# Altium project MB1397.PrjPcb (part 4 of 9)

## Sheet STM32_microcontroller_power.SchDoc: STM32_microcontroller_power
size A4; Date: Not used; ApprovedBy: Not used; CheckedBy: Not used; Author: Not used; CompanyName: STMicroelectronics; DrawnBy: Not used; Engineer: Not used; Organization: Not used; Address1: Not used; Address2: Not used; Address3: Not used; Address4: Not used; DocumentNumber: Not used; Revision: Not used; SheetNumber: 4; SheetTotal: 22; CurrentTime: Not used; CurrentDate: Not used; Time: Not used; DocumentFullPathAndName: Not used; DocumentName: Not used; ModifiedDate: Not used; ImagePath: Not used; ProjectName: Not used; Application_BuildNumber: Not used
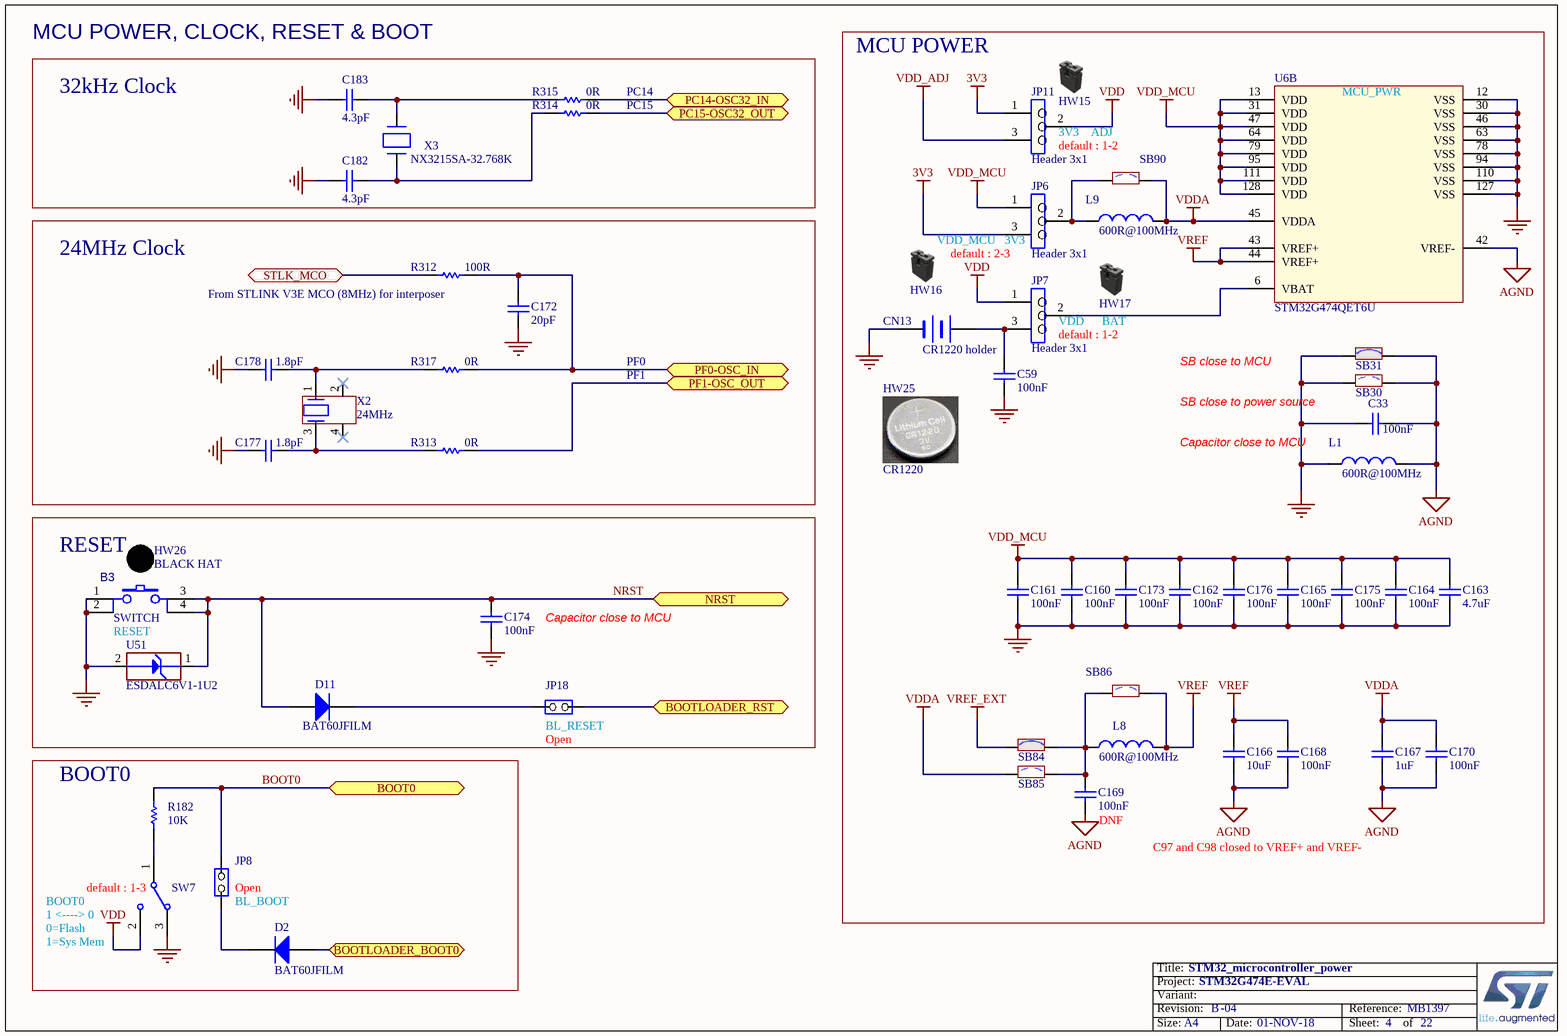
[diagram p10: STM32_microcontroller_power.SchDoc]

### Parts
B3  value SWITCH  [SWI_WEALTHMETAL_TD-0341_4P_BLACK]  (hidden comment: SW-PUSH-CMS)
C33  value 100nF  [C0402]  (hidden comment: Capacitor)
C59  value 100nF  [C0402]  (hidden comment: Capacitor)
C160  value 100nF  [C0402]  (hidden comment: Capacitor)
C161  value 100nF  [C0402]  (hidden comment: Capacitor)
C162  value 100nF  [C0402]  (hidden comment: Capacitor)
C163  value 4.7uF  [C0603]  (hidden comment: Capacitor)
C164  value 100nF  [C0402]  (hidden comment: Capacitor)
C165  value 100nF  [C0402]  (hidden comment: Capacitor)
C166  value 10uF  [C0805]  (hidden comment: Capacitor)
C167  value 1uF  [C0603]  (hidden comment: Capacitor)
C168  value 100nF  [C0402]  (hidden comment: Capacitor)
C169  value 100nF  [C0402]  (hidden comment: Capacitor)
C170  value 100nF  [C0402]  (hidden comment: Capacitor)
C172  value 20pF  [C0402]  (hidden comment: Capacitor)
C173  value 100nF  [C0402]  (hidden comment: Capacitor)
C174  value 100nF  [C0402]  (hidden comment: Capacitor)
C175  value 100nF  [C0402]  (hidden comment: Capacitor)
C176  value 100nF  [C0402]  (hidden comment: Capacitor)
C177  value 1.8pF  [C0402]  (hidden comment: Capacitor)
C178  value 1.8pF  [C0402]  (hidden comment: Capacitor)
C182  value 4.3pF  [C0402]  (hidden comment: Capacitor)
C183  value 4.3pF  [C0402]  (hidden comment: Capacitor)
CN13  value CR1220 holder  [BAT_HARWIN_S8411-45R_SMD_2P]  (hidden comment: BATTERY HOLDER)
D2  BAT60JFILM  [DIO_SOD323]
D11  BAT60JFILM  [DIO_SOD323]
HW15  Shunt Black 2.54mm  (value not drawn)  (mechanical)
HW16  Shunt Black 2.54mm  (value not drawn)  (mechanical)
HW17  Shunt Black 2.54mm  (value not drawn)  (mechanical)
HW25  value CR1220  (hidden comment: BBU_CR1220)  (mechanical)
HW26  value BLACK HAT  (hidden comment: BUTTON_HAT_BLACK)  (mechanical)
JP6  value Header 3x1  [CON_SAMTEC_TSW-103-07-F-S]  (hidden comment: Jumper_Header 3x1)
JP7  value Header 3x1  [CON_SAMTEC_TSW-103-07-F-S]  (hidden comment: Jumper_Header 3x1)
JP8  Jumper_Header 2x1  [CON_SAMTEC_TSW-102-07-G-S]  (value not drawn)
JP11  value Header 3x1  [CON_SAMTEC_TSW-103-07-F-S]  (hidden comment: Jumper_Header 3x1)
JP18  Jumper_Header 2x1  [CON_SAMTEC_TSW-102-07-G-S]  (value not drawn)
L1  value 600R@100MHz  [L0603]  (hidden comment: BEAD)
L8  value 600R@100MHz  [L0603]  (hidden comment: BEAD)
L9  value 600R@100MHz  [L0603]  (hidden comment: BEAD)
R182  value 10K  [R0402]  (hidden comment: Resistor)
R312  value 100R  [R0402]  (hidden comment: Resistor)
R313  value 0R  [R0402]  (hidden comment: Resistor)
R314  value 0R  [R0402]  (hidden comment: Resistor)
R315  value 0R  [R0402]  (hidden comment: Resistor)
R317  value 0R  [R0402]  (hidden comment: Resistor)
SB30  SB_OFF  [SOLDER-BRIDGE_R0603-0R]  (value not drawn)
SB31  SB_ON  [SOLDER-BRIDGE_R0603-0R]  (value not drawn)
SB84  SB_ON  [SOLDER-BRIDGE_R0603-0R]  (value not drawn)
SB85  SB_OFF  [SOLDER-BRIDGE_R0603-0R]  (value not drawn)
SB86  SB_OFF  [SOLDER-BRIDGE_R0603-0R]  (value not drawn)
SB90  SB_OFF  [SOLDER-BRIDGE_R0603-0R]  (value not drawn)
SW7  SW_MECA_1K2  [SWI_EAO_09-03290-01_EXTENDED_STRAIGHT_BLACK]  (value not drawn)
U6  STM32G474QET6U  [ICC_LQFP128_14X14_P040]  (part B of 2)
U51  value ESDALC6V1-1U2  [ESD_ST0201]  (hidden comment: ESD-TRANSIL)
X2  value 24MHz  [CRY_NX2016SA_4P]  (hidden comment: XTAL_4_PINS)
X3  value NX3215SA-32.768K  [CRY_NX3215SA_2P]  (hidden comment: XTAL_2_PINS)

### Blocks framed on the sheet
MCU POWER: C33 C59 C160-C170 C173 C175 C176 CN13 HW15-HW17 HW25 JP6 JP7 JP11 L1 L8 L9 SB30 SB31 SB84-SB86 SB90 U6
24MHz Clock: C172 C177 C178 R312 R313 R317 X2
RESET: B3 C174 D11 HW26 JP18 U51
BOOT0: D2 JP8 R182 SW7

### Ports
BOOT0, BOOTLOADER_BOOT0, BOOTLOADER_RST, NRST, PC14-OSC32_IN, PC15-OSC32_OUT, PF0-OSC_IN, PF1-OSC_OUT, STLK_MCO

### Nets
3V3: JP6.3 JP11.1
AGND: C33.1 C166.1 C167.2 C168.1 C169.1 C170.1 L1.2 SB30.2 SB31.2 U6.42(VREF-)
GND: B3.1 B3.2 C33.2 C59.1 C160.1 C161.1 C162.1 C163.2 C164.1 C165.1 C172.2 C173.1 C174.1 C175.1 C176.1 C177.1 C178.1 C182.1 C183.1 CN13.2(-) L1.1 SB30.1 SB31.1 SW7.3 U6.12(VSS) U6.30(VSS) U6.46(VSS) U6.63(VSS) U6.78(VSS) U6.94(VSS) U6.110(VSS) U6.127(VSS) U51.2(GND)
VDD: JP7.1 JP11.2 SW7.2
VDD_ADJ: JP11.3
VDD_MCU: C160.2 C161.2 C162.2 C163.1 C164.2 C165.2 C173.2 C175.2 C176.2 JP6.1 U6.13(VDD) U6.31(VDD) U6.47(VDD) U6.64(VDD) U6.79(VDD) U6.95(VDD) U6.111(VDD) U6.128(VDD)
VDDA: C167.1 C170.2 L9.2 SB85.1 SB90.2 U6.45(VDDA)
VREF: C166.2 C168.2 L8.2 SB86.2 U6.43(VREF+) U6.44(VREF+)
VREF_EXT: SB84.1
BOOT0: JP8.2(NO) R182.1 ; port BOOT0
NRST: B3.3 B3.4 C174.2 D11.1(A) U51.1(IO1) ; port NRST
PC14: R315.2 ; port PC14-OSC32_IN
PC15: R314.2 ; port PC15-OSC32_OUT
PF0: C172.1 R312.2 R317.2 ; port PF0-OSC_IN
PF1: R313.2 ; port PF1-OSC_OUT
NetC59_2: C59.2 CN13.1(+) JP7.3
NetC169_2: C169.2 L8.1 SB84.2 SB85.2 SB86.1
NetC177_2: C177.2 R313.1 X2.3
NetC178_2: C178.2 R317.1 X2.1
NetC182_2: C182.2 R314.1 X3.1(X1)
NetC183_2: C183.2 R315.1 X3.2(X2)
NetD2_1: D2.1(A) ; port BOOTLOADER_BOOT0
NetD2_2: D2.2(K) JP8.1(COMMON)
NetD11_2: D11.2(K) JP18.1(COMMON)
NetJP6_2: JP6.2 L9.1 SB90.1
NetJP7_2: JP7.2 U6.6(VBAT)
NetJP18_2: JP18.2(NO) ; port BOOTLOADER_RST
NetR182_2: R182.2 SW7.1
NetR312_1: R312.1 ; port STLK_MCO

Not connected (* = marked no-connect by the designer): X2 2* 4*

### Notes on the sheet
- MCU POWER, CLOCK, RESET & BOOT
- 32kHz Clock
- PC14
- PC15
- (near JP11) default : 1-2
- (near JP11) 3V3    ADJ
- VDD_MCU   3V3
- (near R312) From STLINK V3E MCO (8MHz) for interposer
- (near JP6) default : 2-3
- PF0
- PF1
- (near JP7) default : 1-2
- (near JP7) VDD      BAT
- SB close to MCU
- (near L1) Capacitor close to MCU
- SB close to power source
- (near B3) RESET
- Capacitor close to MCU
- (near JP18) Open
- (near JP18) BL_RESET
- (near C169) DNF
- C97 and C98 closed to VREF+ and VREF-
- BOOT0
- (near SW7) 1 <----> 0
- (near SW7) default : 1-3
- (near JP8) Open
- (near JP8) BL_BOOT
- (near SW7) 0=Flash
- (near SW7) 1=Sys Mem
- Title:
- Project:
- Size:
- Revision:
- Variant:
- A4
- -
- Date:
- Reference:
- Sheet:
- of
- (in symbol MCD-01707, part B) MCU_PWR

### Library data of the parts
B3 = MCD-00001: Non-Open Push-Button 0.1A 24V BLACK; Manufacturer_Part_Number: TD-0341; Manufacturer: WEALTHMETAL; Part_Type: Misc; Provided_By: SUBCO; Initial_Board_Reference: MB1274; Remark: update MPN removed color, as it is done by HAT, removed Farnell code as it is not good; Path: ws/MCD_ApplicationBoards/Lists/MCDPARTSdatabase; Item Type: Item; Internal_Part_Number: MCD-00001; ComponentLink1Description: Datasheet; Status: Released; ComponentLink1URL: http://tunmcdsvn.tun.st.com/Component_Datasheet_Library/Trunk/Misc/Wealthmetal_Tact-Switch_TD0341
C33 C59 C160-C162 C164 C165 C168-C170 C173-C176 = MCD-00006: Capacitor, MLCC, 100nF, 16V, X7R, 10%, 0402, T=0.5mm; Manufacturer_Part_Number: CC0402KRX7R7BB104; Manufacturer: YAGEO; Alternate_Manufacturer_Part_Number: GCM155R71C104KA55D; Alternate_Manufacturer: MURATA; Provided_By: SUBCO; Initial_Board_Reference: MB1274; Path: ws/MCD_ApplicationBoards/Lists/MCDPARTSdatabase; Item Type: Item; Internal_Part_Number: MCD-00006; Status: Released; Part_Type: Capacitor; Package: C0402; ComponentLink1Description: Datasheet; ComponentLink1URL: http://tunmcdsvn.tun.st.com/Component_Datasheet_Library/Trunk/Capacitors/Yageo_Multilayer_Capacitor_X7R_series_100pF_to_22uF
C163 = MCD-00009: Capacitor, MLCC, 4.7uF, 16V, X5R, 10%, 0603, T=0.8mm; Manufacturer_Part_Number: CC0603KRX5R7BB475; Manufacturer: YAGEO; Provided_By: SUBCO; Initial_Board_Reference: MB1274; Path: ws/MCD_ApplicationBoards/Lists/MCDPARTSdatabase; Item Type: Item; Internal_Part_Number: MCD-00009; Status: Released; Part_Type: Capacitor; ComponentLink1Description: Datasheet; ComponentLink1URL: http://tunmcdsvn.tun.st.com/Component_Datasheet_Library/Trunk/Capacitors/Yageo_Multilayer_capacitor_X5R_series_100pF_to_100uF; Package: C0603
C166 = MCD-00014: Capacitor, MLCC, 10uF, 25V, X5R, 10%, 0805, T=0,85mm; Manufacturer_Part_Number: CC0805KRX5R8BB106; Manufacturer: YAGEO; Provided_By: SUBCO; Initial_Board_Reference: MB1274; Path: ws/MCD_ApplicationBoards/Lists/MCDPARTSdatabase; Item Type: Item; Internal_Part_Number: MCD-00014; ComponentLink1Description: Datasheet; Status: Released; Part_Type: Capacitor; Package: C0805; ComponentLink1URL: http://tunmcdsvn.tun.st.com/Component_Datasheet_Library/Trunk/Capacitors/Yageo_Multilayer_capacitor_X5R_series_100pF_to_100uF
C167 = MCD-00010: Capacitor, MLCC, 1uF, 16V, X5R, 10%, 0603, T=0,8mm; Manufacturer_Part_Number: CC0603KRX5R7BB105; Manufacturer: YAGEO; Provided_By: SUBCO; Initial_Board_Reference: MB1274; Path: ws/MCD_ApplicationBoards/Lists/MCDPARTSdatabase; Item Type: Item; Internal_Part_Number: MCD-00010; Status: Released; Part_Type: Capacitor; ComponentLink1Description: Datasheet; ComponentLink1URL: http://tunmcdsvn.tun.st.com/Component_Datasheet_Library/Trunk/Capacitors/Yageo_Multilayer_capacitor_X5R_series_100pF_to_100uF; Package: C0603
C172 = MCD-00016: Capacitor, MLCC, 20pF, 50V, NPO, 5%, 0402, T=0,5mm; Manufacturer_Part_Number: CC0402JRNPO9BN200; Manufacturer: YAGEO; Provided_By: SUBCO; Initial_Board_Reference: MB1274; Path: ws/MCD_ApplicationBoards/Lists/MCDPARTSdatabase; Item Type: Item; Internal_Part_Number: MCD-00016; Status: Released; Package: C0402; ComponentLink1Description: Datasheet; Part_Type: Capacitor; ComponentLink1URL: http://tunmcdsvn.tun.st.com/Component_Datasheet_Library/Trunk/Capacitors/Yageo_Capacitor_NP0_16V-to-50V
C177 C178 = MCD-01598: Capacitor, MLCC, 1.8pF, 50V, NPO, +-0.25pF, 0402, T=0,5mm; Manufacturer_Part_Number: CC0402CRNPO9BN1R8; Manufacturer: YAGEO; Provided_By: SUBCO; Internal_Part_Number: MCD-01598; Status: Released; Part_Type: Capacitor; Package: C0402; ComponentLink1Description: Datasheet; ComponentLink1URL: http://tunmcdsvn.tun.st.com/Component_Datasheet_Library/Trunk/Capacitors/Yageo_Capacitor_NP0_16V-to-50V
C182 C183 = MCD-01706: Capacitor, MLCC, 4.3pF, 50V, NPO, +-0.25pF, 0402, T=0,5mm; Manufacturer_Part_Number: CC0402CRNPO9BN4R3; Manufacturer: YAGEO; Provided_By: SUBCO; Internal_Part_Number: MCD-01706; Status: Footprint available; Part_Type: Capacitor; Package: C0402; ComponentLink1Description: Datasheet; ComponentLink1URL: http://tunmcdsvn.tun.st.com/Component_Datasheet_Library/Trunk/Capacitors/Yageo_Capacitor_NP0_16V-to-50V
CN13 = MCD-00558: Battery Coin Cell holder, CR1220_12mm, Height 4.25mm; Part_Type: Connector; Manufacturer_Part_Number: S8411-45R; Manufacturer: HARWIN; Provided_By: SUBCO; Initial_Board_Reference: MB1331; Path: ws/MCD_ApplicationBoards/Lists/MCDPARTSdatabase; Item Type: Item; Internal_Part_Number: MCD-00558; Status: Released; ComponentLink1Description: Datasheet; ComponentLink1URL: http://tunmcdsvn.tun.st.com/Component_Datasheet_Library/Trunk/Connectors/Harwin_S8_series
D2 D11 = MCD-00034: Manufacturer: STMICROELECTRONICS; Part_Type: Diode; BMS_Part_Number: 9151097; Provided_By: SUBCO with ST control; Initial_Board_Reference: MB1274; Path: ws/MCD_ApplicationBoards/Lists/MCDPARTSdatabase; Item Type: Item; Internal_Part_Number: MCD-00034; Value: BAT60JFILM; Manufacturer_Part_Number: BAT60JFILM; ComponentLink1Description: Datasheet; Status: Released; ComponentLink1URL: http://tunmcdsvn.tun.st.com/Component_Datasheet_Library/Trunk/Diodes/STM_Diode_BAT60JFILM-SOD323
HW15-HW17 = MCD-00043: SHUNT 2.54mm BLACK; Part_Type: Mechanical; Manufacturer_Part_Number: SNT-100-BK-G; Manufacturer: SAMTEC; Provided_By: SUBCO; Initial_Board_Reference: MB1274; Value: SNT-100-BK-G; Path: ws/MCD_ApplicationBoards/Lists/MCDPARTSdatabase; Item Type: Item; Internal_Part_Number: MCD-00043; Status: Released; ComponentLink1Description: Datasheet; ComponentLink1URL: http://tunmcdsvn.tun.st.com/Component_Datasheet_Library/Trunk/Connectors/Samtec_Shunt_Jumper_SNT100
HW25 = MCD-01197: Battery Back-Up CR1220,3V,12X2.0MM,35mA; Part_Type: Misc; Manufacturer: tbd; Alternate_Manufacturer_Part_Number: 988.16.04.2.00003; Alternate_Manufacturer: Jiubaba; Provided_By: SUBCO; Initial_Board_Reference: MB1372; Remark: Mechanical part, no footprint.; Path: ws/MCD_ApplicationBoards/Lists/MCDPARTSdatabase; Item Type: Item; Internal_Part_Number: MCD-01197; Status: Checked; Manufacturer_Part_Number: CR1220; Package: CR1220; ComponentLink1Description: Datasheet; ComponentLink1URL: http://na
HW26 = MCD-00635: Black Hat for switch TD0341X-G01-BLA; Part_Type: Mechanical; Manufacturer_Part_Number: 988.16.09.3.00003_SH-517; Manufacturer: JIUBABA; Provided_By: SUBCO; Initial_Board_Reference: MB1319; Item Type: Item; Path: ws/MCD_ApplicationBoards/Lists/MCDPARTSdatabase; Internal_Part_Number: MCD-00635; Status: Released; ComponentLink1Description: Datasheet; ComponentLink1URL: http://tunmcdsvn.tun.st.com/Component_Datasheet_Library/Trunk/Mechanical/Jiubaba_HAT_SH-517
JP6 JP7 JP11 = MCD-00111: Header, 3x1, 2,54mm, VR, TH, Height 5.84mm/2.54mm; Part_Type: Connector; Manufacturer_Part_Number: TSW-103-07-F-S; Manufacturer: SAMTEC; Provided_By: SUBCO; Initial_Board_Reference: MB1262; Path: ws/MCD_ApplicationBoards/Lists/MCDPARTSdatabase; Item Type: Item; Internal_Part_Number: MCD-00111; Status: Released; ComponentLink1Description: Datasheet; ComponentLink1URL: http://tunmcdsvn.tun.st.com/Component_Datasheet_Library/Trunk/Connectors/Samtec_TSW-HTSW-series
JP8 JP18 = MCD-00045: Header, 2x1, 2,54mm, VR, TH, Height 5.84mm/2.54mm; Manufacturer_Part_Number: TSW-102-07-x-S; Manufacturer: SAMTEC; Part_Type: Connector; Value: Shunt not fitted; Provided_By: SUBCO; Initial_Board_Reference: MB1274; Path: ws/MCD_ApplicationBoards/Lists/MCDPARTSdatabase; Item Type: Item; Internal_Part_Number: MCD-00045; ComponentLink1Description: Datasheet; Status: Released; ComponentLink1URL: http://tunmcdsvn.tun.st.com/Component_Datasheet_Library/Trunk/Connectors/Samtec_TSW-HTSW-series
L1 L8 L9 = MCD-00047: SMD Chip ferrite bead, 600R@100MHz +/-25%, 350mA, 500mohm DC, 0603, T=0.8mm; Part_Type: Inductor; Manufacturer_Part_Number: FCM1608KF-601T03; Manufacturer: TAI-TECH; Provided_By: SUBCO; Initial_Board_Reference: MB1274; Path: ws/MCD_ApplicationBoards/Lists/MCDPARTSdatabase; Item Type: Item; Internal_Part_Number: MCD-00047; Status: Released; ComponentLink1Description: Datasheet; ComponentLink1URL: http://tunmcdsvn.tun.st.com/Component_Datasheet_Library/Trunk/Inductors/TaiTech_Bead_FCM1608_series
R182 = MCD-00053: Resistor,10K,0402,1%,1/16W; Manufacturer_Part_Number: RC0402FR-0710KL; Manufacturer: YAGEO; Provided_By: SUBCO; Initial_Board_Reference: MB1274; Path: ws/MCD_ApplicationBoards/Lists/MCDPARTSdatabase; Item Type: Item; Internal_Part_Number: MCD-00053; ComponentLink1Description: Datasheet; Status: Released; Part_Type: Resistor; Package: R0402; ComponentLink1URL: http://tunmcdsvn.tun.st.com/Component_Datasheet_Library/Trunk/Resistors/Yageo_Resistor_RC0402-series
R312 = MCD-00119: Resistor,100R,0402,1%,1/16W; Manufacturer_Part_Number: RC0402FR-07100RL; Manufacturer: YAGEO; Provided_By: SUBCO; Initial_Board_Reference: MB1262; Path: ws/MCD_ApplicationBoards/Lists/MCDPARTSdatabase; Item Type: Item; Internal_Part_Number: MCD-00119; Status: Released; Part_Type: Resistor; ComponentLink1Description: Datasheet; Package: R0402; ComponentLink1URL: http://tunmcdsvn.tun.st.com/Component_Datasheet_Library/Trunk/Resistors/Yageo_Resistor_RC0402-series
R313-R315 R317 = MCD-00052: Resistor,0R,0402,5%,1/16W; Manufacturer_Part_Number: RC0402JR-070RL; Manufacturer: YAGEO; Provided_By: SUBCO; Initial_Board_Reference: MB1274; Path: ws/MCD_ApplicationBoards/Lists/MCDPARTSdatabase; Item Type: Item; Internal_Part_Number: MCD-00052; Status: Released; Part_Type: Resistor; Package: R0402; ComponentLink1Description: Datasheet; ComponentLink1URL: http://tunmcdsvn.tun.st.com/Component_Datasheet_Library/Trunk/Resistors/Yageo_Resistor_RC0402-series
SB30 SB85 SB86 SB90 = MCD-00072: Solder Bridge OFF; Part_Type: Mechanical; Manufacturer_Part_Number: RC0603JR-070RL; Manufacturer: YAGEO; Provided_By: SUBCO; Initial_Board_Reference: MB1274; Path: ws/MCD_ApplicationBoards/Lists/MCDPARTSdatabase; Item Type: Item; Internal_Part_Number: MCD-00072; Status: Released; ComponentLink1Description: Datasheet; Package: SB0603; ComponentLink1URL: http://tunmcdsvn.tun.st.com/Component_Datasheet_Library/Trunk/Resistors/Yageo_Resistor_RC0603-series
SB31 SB84 = MCD-00071: Solder Bridge ON; Part_Type: Mechanical; Manufacturer_Part_Number: RC0603JR-070RL; Manufacturer: YAGEO; Provided_By: SUBCO; Initial_Board_Reference: MB1274; Path: ws/MCD_ApplicationBoards/Lists/MCDPARTSdatabase; Item Type: Item; Internal_Part_Number: MCD-00071; Status: Released; ComponentLink1Description: Datasheet; Package: SB0603; ComponentLink1URL: http://tunmcdsvn.tun.st.com/Component_Datasheet_Library/Trunk/Resistors/Yageo_Resistor_RC0603-series
SW7 = MCD-00566: Mechanical Slide Switches 1K2 BLK ACT GOLD STRT MNT; Part_Type: Misc; Manufacturer_Part_Number: 09.03290.01; Manufacturer: EAO; Value: Mechanical Slide Switch 1K2; Provided_By: SUBCO; Initial_Board_Reference: MB1331; Path: ws/MCD_ApplicationBoards/Lists/MCDPARTSdatabase; Item Type: Item; Internal_Part_Number: MCD-00566; Status: Checked; ComponentLink1Description: Datasheet; ComponentLink1URL: http://tunmcdsvn.tun.st.com/Component_Datasheet_Library/Trunk/Misc/EAO_SWITCH_09.03290.01
U6 = MCD-01707: ARM® Cortex®-M4 32-bit MCU, 512 KB Flash, 96 KB RAM, 5x USART, timers, ADC, DAC, comm. I/F, 1.65-3.6V; Part_Type: IC; Manufacturer: STMICROELECTRONICS; Provided_By: SUBCO with ST control; Internal_Part_Number: MCD-01707; Value: STM32G474QET6U; Status: Released; Manufacturer_Part_Number: STM32G474QET6U; Package: LQFP128; ComponentLink1Description: Datasheet; ComponentLink1URL: http://tunmcdsvn.tun.st.com/Component_Datasheet_Library/Trunk/IC/STM_MCU_STM32G474WET6
U51 = MCD-00170: ESD protection 6V1; Part_Type: Diode; Manufacturer: STMICROELECTRONICS; BMS_Part_Number: 9151132; Provided_By: SUBCO with ST control; Initial_Board_Reference: MB1274; Path: ws/MCD_ApplicationBoards/Lists/MCDPARTSdatabase; Item Type: Item; Internal_Part_Number: MCD-00170; Status: Released; Manufacturer_Part_Number: ESDALC6V1-1U2; ComponentLink1Description: Datasheet; ComponentLink1URL: http://tunmcdsvn.tun.st.com/Component_Datasheet_Library/Trunk/Diodes/STM_ESD_ESDALC6V1-1U2
X2 = MCD-01036: 24MHz crystal oscillator - Cl:6pf -; Part_Type: Crystal_Osc; Manufacturer_Part_Number: NX2016SA 24MHz EXS00A-CS10820; Manufacturer: NDK; BMS_Part_Number: 9157045; Provided_By: ST; Initial_Board_Reference: MB1332; Path: ws/MCD_ApplicationBoards/Lists/MCDPARTSdatabase; Item Type: Item; Internal_Part_Number: MCD-01036; Status: Checked; Package: (2016) 2.0 x 1.6 x 0.45 mm; ComponentLink1Description: Datasheet; ComponentLink1URL: http://tunmcdsvn.tun.st.com/Component_Datasheet_Library/Trunk/Crystal_Osc/NDK_NX2016SA 24MHz EXS00A-CS10820 (EXS10B-27366B)
X3 = MCD-00091: Crystal 32.768kHz, 6pF, -+20PPM, R=50K, SMD; Part_Type: Crystal_Osc; Manufacturer_Part_Number: NX3215SA 32.768KHz EXS00A-MU00525; Manufacturer: NDK; BMS_Part_Number: 9157034; Provided_By: ST; Initial_Board_Reference: MB1274; Path: ws/MCD_ApplicationBoards/Lists/MCDPARTSdatabase; Item Type: Item; Internal_Part_Number: MCD-00091; Status: Released; ComponentLink1Description: Datasheet; ComponentLink1URL: http://tunmcdsvn.tun.st.com/Component_Datasheet_Library/Trunk/Crystal_Osc/NDK_Crystal-For-ST_NX3215SA 32.768KHz EXS00A-MU00525 (EXS10B-21238)

## Sheet Power_Board.SchDoc: Board Power
size A4; Date: Not used; ApprovedBy: Not used; CheckedBy: Not used; Author: Not used; CompanyName: STMicroelectronics; DrawnBy: Not used; Engineer: Not used; Organization: Not used; Address1: Not used; Address2: Not used; Address3: Not used; Address4: Not used; DocumentNumber: Not used; Revision: Not used; SheetNumber: 20; SheetTotal: 22; CurrentTime: Not used; CurrentDate: Not used; Time: Not used; DocumentFullPathAndName: Not used; DocumentName: Not used; ModifiedDate: Not used; ImagePath: Not used; ProjectName: Not used; Application_BuildNumber: Not used
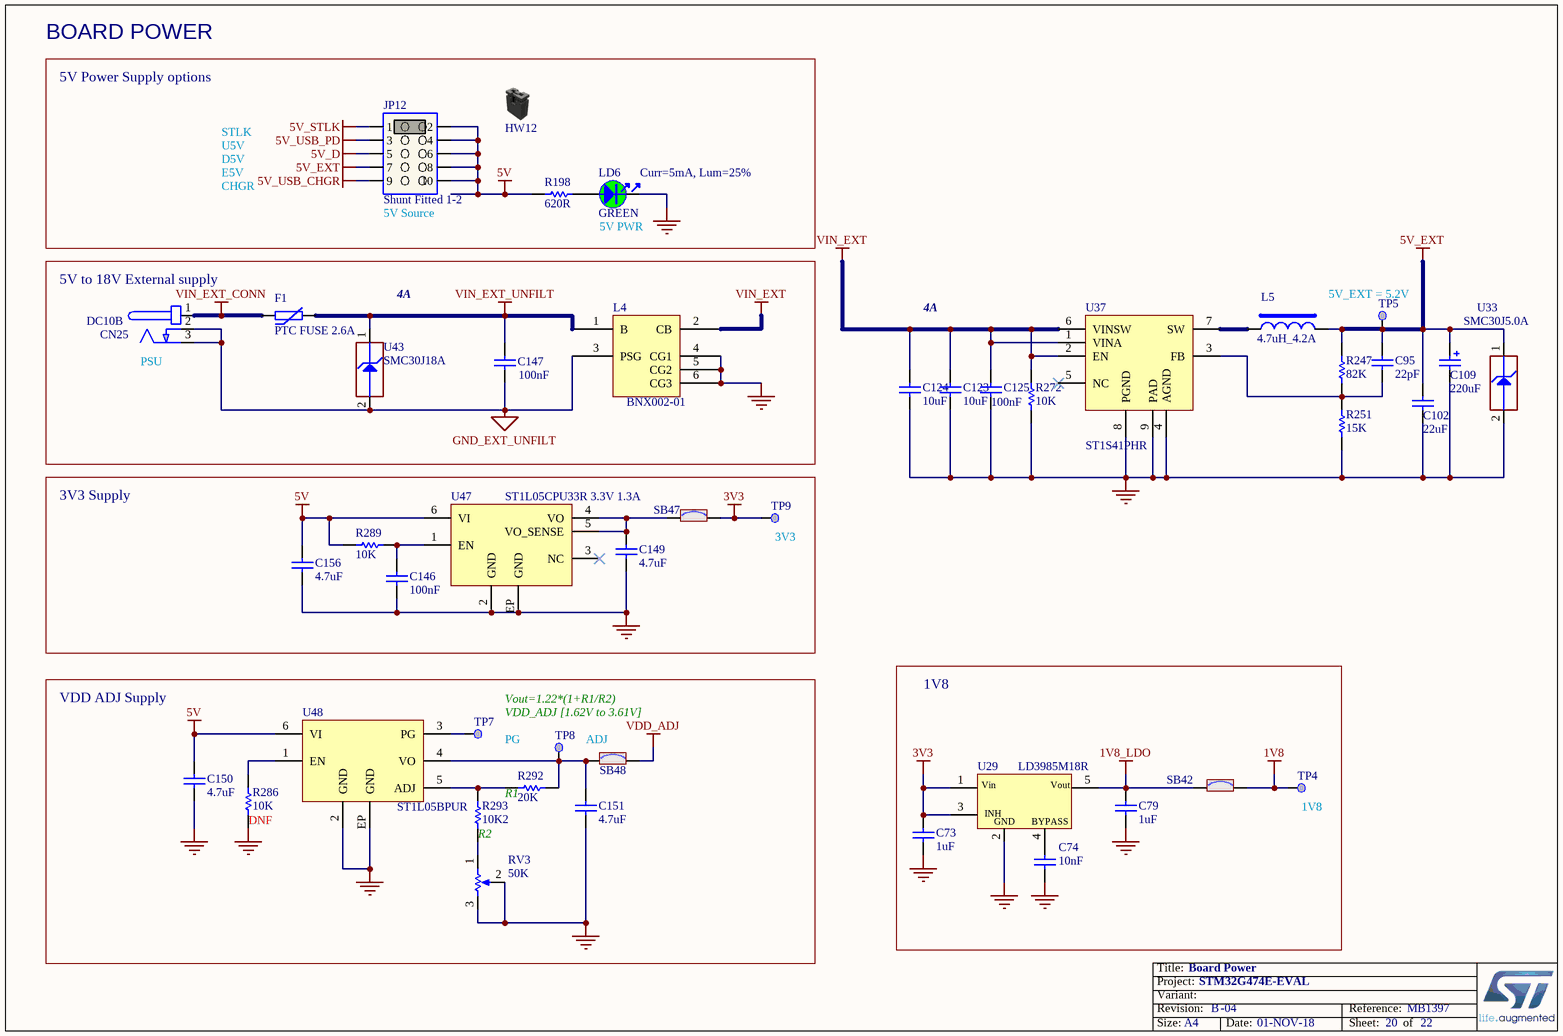
[diagram p11: Power_Board.SchDoc]

### Parts
C73  value 1uF  [C0603]  (hidden comment: Capacitor)
C74  value 10nF  [C0402]  (hidden comment: Capacitor)
C79  value 1uF  [C0603]  (hidden comment: Capacitor)
C95  value 22pF  [C0402]  (hidden comment: Capacitor)
C102  value 22uF  [C0805]  (hidden comment: Capacitor)
C109  value 220uF  [CPOL_TAJ-C_2312_H2P6]  (hidden comment: Cap_POL_TANA)
C123  value 10uF  [C1210]  (hidden comment: Capacitor)
C124  value 10uF  [C1210]  (hidden comment: Capacitor)
C125  value 100nF  [C0402]  (hidden comment: Capacitor)
C146  value 100nF  [C0402]  (hidden comment: Capacitor)
C147  value 100nF  [C0402]  (hidden comment: Capacitor)
C149  value 4.7uF  [C0603]  (hidden comment: Capacitor)
C150  value 4.7uF  [C0603]  (hidden comment: Capacitor)
C151  value 4.7uF  [C0603]  (hidden comment: Capacitor)
C156  value 4.7uF  [C0603]  (hidden comment: Capacitor)
CN25  value DC10B  [CON_DC-POWER-SOCKET_CLIFF_FC68149_DC10B]  (hidden comment: Power_Jack_DC10B)
F1  value PTC FUSE 2.6A  [PTC_BEL-FUSE_1812_0ZCG0260FF2C]  (hidden comment: 0ZCG0260FF2C)
HW12  Shunt Black 2.54mm  (value not drawn)  (mechanical)
JP12  value Shunt Fitted 1-2  [CON_SAMTEC_TSW-105-07-X-D]  (hidden comment: Jumper_Header 5x2 Fitted 1-2)
L4  BNX002-01  [FIL_MURATA_BNX002-01]
L5  value 4.7uH_4.2A  [IND_TDK_VLS6045EX-4R7M]  (hidden comment: INDUCTOR_POWER)
LD6  value GREEN  [LED_0603_OSRAM_LG-Q396-PS-35_GREEN_1A2K_H0P4]  (hidden comment: LED_green)
R198  value 620R  [R0603]  (hidden comment: Resistor)
R247  value 82K  [R0402]  (hidden comment: Resistor)
R251  value 15K  [R0402]  (hidden comment: Resistor)
R272  value 10K  [R0402]  (hidden comment: Resistor)
R286  value 10K  [R0402]  (hidden comment: Resistor)
R289  value 10K  [R0402]  (hidden comment: Resistor)
R292  value 20K  [R0603]  (hidden comment: Resistor)
R293  value 10K2  [R0603]  (hidden comment: Resistor)
RV3  value 50K  [POT_BOURNS_3386P]  (hidden comment: POTENTIOMETER)
SB42  SB_ON  [SOLDER-BRIDGE_R0603-0R]  (value not drawn)
SB47  SB_ON  [SOLDER-BRIDGE_R0603-0R]  (value not drawn)
SB48  SB_ON  [SOLDER-BRIDGE_R0603-0R]  (value not drawn)
TP4  Test Point  [TP_SMD_1MM]  (value not drawn)  (no BOM)
TP5  Test Point  [TP_SMD_1MM]  (value not drawn)  (no BOM)
TP7  Test Point  [TP_SMD_1MM]  (value not drawn)  (no BOM)
TP8  Test Point  [TP_SMD_1MM]  (value not drawn)  (no BOM)
TP9  Test Point  [TP_SMD_1MM]  (value not drawn)  (no BOM)
U29  LD3985M18R  [REG_SOT23-5L]
U33  value SMC30J5.0A  [DIO_SMC_DO214-AB_1K_2A]  (hidden comment: ESD-TRANSIL)
U37  value ST1S41PHR  [ICC_HSOP8-EPAD_3P90X4P90_P127]  (hidden comment: ST1S41)
U43  value SMC30J18A  [DIO_SMC_DO214-AB_1K_2A]  (hidden comment: ESD-TRANSIL)
U47  value ST1L05CPU33R 3.3V 1.3A  [ICC_DFN6-EPAD_3X3_P095]  (hidden comment: ST1L05CPU33R)
U48  ST1L05BPUR  [ICC_DFN6-EPAD_3X3_P095]

### Blocks framed on the sheet
BOARD POWER: HW12 JP12 LD6 R198
5V to 18V External supply: C147 CN25 F1 L4 U43
3V3 Supply: C146 C149 C156 R289 SB47 TP9 U47
1V8: C73 C74 C79 SB42 TP4 U29
VDD ADJ Supply: C150 C151 R286 R292 R293 RV3 SB48 TP7 TP8 U48

### Nets
1V8: SB42.2 TP4.1
1V8_LDO: C79.2 SB42.1 U29.5(Vout)
3V3: C73.2 SB47.2 TP9.1 U29.1(Vin) U29.3(CE)
5V: C150.1 C156.2 JP12.2 JP12.4 JP12.6 JP12.8 JP12.10 R198.1 R289.2 U47.6(VI) U48.6(VI)
5V_D: JP12.5
5V_EXT: C95.2 C102.2 C109.1 JP12.7 L5.2 R247.2 TP5.1 U33.1(IO1)
5V_STLK: JP12.1
5V_USB_CHGR: JP12.9
5V_USB_PD: JP12.3
GND: C73.1 C74.1 C79.1 C102.1 C109.2 C123.1 C124.1 C125.1 C146.2 C149.1 C150.2 C151.1 C156.1 L4.4(CG1) L4.5(CG2) L4.6(CG3) LD6.2 R251.1 R272.1 R286.2 RV3.2(TAP) RV3.3(TOP) U29.2(GND) U33.2(GND) U37.4(AGND) U37.8(PGND) U37.9(PAD) U47.2(GND) U47.EP(GND) U48.2(GND) U48.EP(GND)
GND_EXT_UNFILT: C147.2 CN25.2 CN25.3 L4.3(PSG) U43.2(GND)
VDD_ADJ: SB48.2
VIN_EXT: C123.2 C124.2 C125.2 L4.2(CB) R272.2 U37.1(VINA) U37.2(EN) U37.6(VINSW)
VIN_EXT_CONN: CN25.1 F1.1
VIN_EXT_UNFILT: C147.1 F1.2 L4.1(B) U43.1(IO1)
NetC74_2: C74.2 U29.4(BYPASS)
NetC95_1: C95.1 R247.1 R251.2 U37.3(FB)
NetC146_1: C146.1 R289.1 U47.1(EN)
NetC149_2: C149.2 SB47.1 U47.4(VO) U47.5(VO_SENSE)
NetC151_2: C151.2 R292.2 SB48.1 TP8.1 U48.4(VO)
NetL5_1: L5.1 U37.7(SW)
NetLD6_1: LD6.1 R198.2
NetR286_1: R286.1 U48.1(EN)
NetR292_1: R292.1 R293.2 U48.5(ADJ)
NetR293_1: R293.1 RV3.1(BOT)
NetTP7_1: TP7.1 U48.3(PG)

Not connected (* = marked no-connect by the designer): U37 5(NC)*; U47 3(NC)*

### Notes on the sheet
- 5V Power Supply options
- D5V
- E5V
- U5V
- STLK
- (near LD6) Curr=5mA, Lum=25%
- CHGR
- (near JP12) 5V Source
- 5V PWR
- (near U43) 4A
- 4A
- (near TP5) 5V_EXT = 5.2V
- (near CN25) PSU
- (near TP9) 3V3
- Vout=1.22*(1+R1/R2)
- VDD_ADJ [1.62V to 3.61V]
- PG
- (near SB48) ADJ
- (near R286) DNF
- (near R293) R2
- (near R292) R1
- (near TP4) 1V8
- Title:
- Project:
- Size:
- Revision:
- Variant:
- A4
- -
- Date:
- Reference:
- Sheet:
- of
- (in symbol MCD-00078) INH

### Library data of the parts
C73 C79 = MCD-00010: as C167 on sheet STM32_microcontroller_power; Internal_Part_Number: MCD-00010; Status: Released; Part_Type: Capacitor; Package: C0603; ComponentLink1Description: Datasheet; ComponentLink1URL: http://tunmcdsvn.tun.st.com/Component_Datasheet_Library/Trunk/Capacitors/Yageo_Multilayer_capacitor_X5R_series_100pF_to_100uF
C74 = MCD-00011: Capacitor, MLCC, 10nF, 16V, X7R, 10%, 0402, T=0.5mm; Manufacturer_Part_Number: CC0402KRX7R7BB103; Manufacturer: YAGEO; Provided_By: SUBCO; Initial_Board_Reference: MB1274; Path: ws/MCD_ApplicationBoards/Lists/MCDPARTSdatabase; Item Type: Item; Internal_Part_Number: MCD-00011; Status: Released; Package: C0402; ComponentLink1Description: Datasheet; Part_Type: Capacitor; ComponentLink1URL: http://tunmcdsvn.tun.st.com/Component_Datasheet_Library/Trunk/Capacitors/Yageo_Multilayer_Capacitor_X7R_series_100pF_to_22uF
C95 = MCD-00203: Capacitor, MLCC, 22pF, 50V, C0G, 5%, 0402, T=0,5mm; Manufacturer_Part_Number: GRM1555C1H220JA01; Manufacturer: MURATA; Provided_By: SUBCO; Initial_Board_Reference: MBxxxx; Path: ws/MCD_ApplicationBoards/Lists/MCDPARTSdatabase; Item Type: Item; Internal_Part_Number: MCD-00203; Status: Released; Part_Type: Capacitor; Package: C0402; ComponentLink1Description: Datasheet; ComponentLink1URL: http://tunmcdsvn.tun.st.com/Component_Datasheet_Library/Trunk/Capacitors/Murata_Capacitor_GR_series
C102 = MCD-00101: Capacitor, MLCC, 22uF, 6V3, X5R, 20%, 0805, T=1,25mm; Manufacturer_Part_Number: GRM21BR60J226ME39L; Manufacturer: MURATA; Provided_By: SUBCO; Initial_Board_Reference: MB1262; Path: ws/MCD_ApplicationBoards/Lists/MCDPARTSdatabase; Item Type: Item; Internal_Part_Number: MCD-00101; Status: Released; Part_Type: Capacitor; Package: C0805; ComponentLink1Description: Datasheet; ComponentLink1URL: http://tunmcdsvn.tun.st.com/Component_Datasheet_Library/Trunk/Capacitors/Murata_Capacitor_GR_series
C109 = MCD-00142: Capacitor, Tantalum, 220uF, 10V, 10%, TypeC; Manufacturer_Part_Number: TAJC227K010R; Manufacturer: AVX; Provided_By: SUBCO; Initial_Board_Reference: MB1262; Path: ws/MCD_ApplicationBoards/Lists/MCDPARTSdatabase; Item Type: Item; Revision: July-2002: Re-released for DXP Platform.; Internal_Part_Number: MCD-00142; ComponentLink1Description: Datasheet; Status: Released; Part_Type: Capacitor; Package: C2312; ComponentLink1URL: http://tunmcdsvn.tun.st.com/Component_Datasheet_Library/Trunk/Capacitors/AVX_Capacitor_TAJ-series
C123 C124 = MCD-01056: Capacitor, X7R, 10µF, 50V, 20%, 1210, T=2.5mm; Manufacturer_Part_Number: C3225X7R1H106M250AC; Manufacturer: TDK; Provided_By: SUBCO; Initial_Board_Reference: MB1378; Remark: Footprint available C1210; Path: ws/MCD_ApplicationBoards/Lists/MCDPARTSdatabase; Item Type: Item; Internal_Part_Number: MCD-01056; Status: Footprint available; Part_Type: Capacitor; Package: C1210; ComponentLink1Description: Datasheet; ComponentLink1URL: http://tunmcdsvn.tun.st.com/Component_Datasheet_Library/Trunk/Capacitors/TDK_Capacitor_C-series; Order_Code_Farnell: 2547040
C125 C146 C147 = MCD-00006: as C33 on sheet STM32_microcontroller_power; Internal_Part_Number: MCD-00006; Status: Released; Part_Type: Capacitor; Package: C0402; ComponentLink1Description: Datasheet; ComponentLink1URL: http://tunmcdsvn.tun.st.com/Component_Datasheet_Library/Trunk/Capacitors/Yageo_Multilayer_Capacitor_X7R_series_100pF_to_22uF
C149-C151 C156 = MCD-00009: as C163 on sheet STM32_microcontroller_power; Internal_Part_Number: MCD-00009; Status: Released; Part_Type: Capacitor; Package: C0603; ComponentLink1Description: Datasheet; ComponentLink1URL: http://tunmcdsvn.tun.st.com/Component_Datasheet_Library/Trunk/Capacitors/Yageo_Multilayer_capacitor_X5R_series_100pF_to_100uF
CN25 = MCD-00173: DC-Power-Jack, 2.5mm, 5A, RA, TH; Manufacturer: CLIFF; Part_Type: Connector; BMS_Part_Number: 9087803; Provided_By: SUBCO; Initial_Board_Reference: MB1265; Path: ws/MCD_ApplicationBoards/Lists/MCDPARTSdatabase; Item Type: Item; Internal_Part_Number: MCD-00173; Manufacturer_Part_Number: DC10B; ComponentLink1Description: Datasheet; Status: Released; ComponentLink1URL: http://tunmcdsvn.tun.st.com/Component_Datasheet_Library/Trunk/Connectors/CLIFF_DC Power Connectors_DC10B
F1 = MCD-00624: SMD, PTC resettable fuse, IH:2.6A, IT:5A, Vdc_max:8V, Rmax:47mohm, BELFUSE; Part_Type: Misc; Provided_By: SUBCO; Initial_Board_Reference: MB1264; Path: ws/MCD_ApplicationBoards/Lists/MCDPARTSdatabase; Item Type: Item; Internal_Part_Number: MCD-00624; Status: Footprint available; Manufacturer_Part_Number: 0ZCG0260FF2C; Manufacturer: BELFUSE; ComponentLink1Description: Datasheet; ComponentLink1URL: http://tunmcdsvn.tun.st.com/Component_Datasheet_Library/Trunk/Misc/BELFUSE_FUSE_PTC_0ZCG_series
HW12 = MCD-00043: as HW15-HW17 on sheet STM32_microcontroller_power; Internal_Part_Number: MCD-00043; Status: Released; ComponentLink1Description: Datasheet; ComponentLink1URL: http://tunmcdsvn.tun.st.com/Component_Datasheet_Library/Trunk/Connectors/Samtec_Shunt_Jumper_SNT100
JP12 = MCD-01203: Header, 5x2, 2,54mm, VR, TH, Height 5.84mm/2.54mm - Shunt Fitted 1-2; Part_Type: Connector; Manufacturer_Part_Number: TSW-105-07-x-D; Manufacturer: SAMTEC; Provided_By: SUBCO; Initial_Board_Reference: MB1372; Path: ws/MCD_ApplicationBoards/Lists/MCDPARTSdatabase; Item Type: Item; Internal_Part_Number: MCD-01203; Status: Released; ComponentLink1Description: Datasheet; ComponentLink1URL: http://tunmcdsvn.tun.st.com/Component_Datasheet_Library/Trunk/Connectors/Samtec_TSW-HTSW-series
L4 = MCD-00150: Through HOLE DC power EMI line filter, 40dB min (1MHz - 1GHz) insertion loss; Manufacturer: MURATA; Part_Type: Inductor; BMS_Part_Number: 9049203; Provided_By: SUBCO; Initial_Board_Reference: MB1263; Path: ws/MCD_ApplicationBoards/Lists/MCDPARTSdatabase; Item Type: Item; Internal_Part_Number: MCD-00150; Value: BNX002-01; Manufacturer_Part_Number: BNX002-01; ComponentLink1Description: Datasheet; Status: Released; ComponentLink1URL: http://tunmcdsvn.tun.st.com/Component_Datasheet_Library/Trunk/Inductors/Murata_EMI filter_BNX0002-1
L5 = MCD-01239: FIXED IND 4.7UH 4.2A 35 MOHM SMD; Manufacturer_Part_Number: VLS6045EX-4R7M; Manufacturer: TDK; Provided_By: SUBCO; Initial_Board_Reference: MB1397; Path: ws/MCD_ApplicationBoards/Lists/MCDPARTSdatabase; Item Type: Item; Internal_Part_Number: MCD-01239; Status: Footprint available; Part_Type: Inductor; ComponentLink1Description: Datasheet; ComponentLink1URL: http://tunmcdsvn.tun.st.com/Component_Datasheet_Library/Trunk/Inductors/TDK_Inductor_VLS6045EX-4R7M
LD6 = MCD-00588: LED Green, 0603 SMD, Forward Voltage Typ=2V, Max=2.5V; Part_Type: Display; Manufacturer_Part_Number: LG Q396-PS-35; Manufacturer: OSRAM OPTO SEMICONDUCTORS; Alternate_Manufacturer_Part_Number: VLMTG1300-GS08; Alternate_Manufacturer: VISHAY SEMICONDUCTOR OPTO DIVISION; Provided_By: SUBCO; Initial_Board_Reference: MB1331; Path: ws/MCD_ApplicationBoards/Lists/MCDPARTSdatabase; Item Type: Item; Internal_Part_Number: MCD-00588; Status: Released; Package: LED 0603; ComponentLink1Description: Datasheet; ComponentLink1URL: http://tunmcdsvn.tun.st.com/Component_Datasheet_Library/Trunk/Display/OSRAM_LED_GREEN_LG Q396-PS-35; Order_Code_Digikey: LG Q396-PS-35-ND
R198 = MCD-00500: Resistor,620R,0603,1%,1/10W; Manufacturer_Part_Number: RC0603FR-07620RL; Manufacturer: YAGEO; Provided_By: SUBCO; Initial_Board_Reference: MBxxxx; Path: ws/MCD_ApplicationBoards/Lists/MCDPARTSdatabase; Item Type: Item; Internal_Part_Number: MCD-00500; Status: Released; Part_Type: Resistor; Package: R0603; ComponentLink1Description: Datasheet; ComponentLink1URL: http://tunmcdsvn.tun.st.com/Component_Datasheet_Library/Trunk/Resistors/Yageo_Resistor_RC0603-series
R247 = MCD-00531: Resistor,82K,0402,1%,1/16W; Manufacturer_Part_Number: RC0402FR-0782KL; Manufacturer: YAGEO; Provided_By: SUBCO; Initial_Board_Reference: MBxxxx; Path: ws/MCD_ApplicationBoards/Lists/MCDPARTSdatabase; Item Type: Item; Internal_Part_Number: MCD-00531; Status: Released; Part_Type: Resistor; Package: R0402; ComponentLink1Description: Datasheet; ComponentLink1URL: http://tunmcdsvn.tun.st.com/Component_Datasheet_Library/Trunk/Resistors/Yageo_Resistor_RC0402-series
R251 = MCD-00285: Resistor,15K,0402,5%,1/16W; Manufacturer_Part_Number: RC0402JR-0715KL; Manufacturer: YAGEO; Provided_By: SUBCO; Initial_Board_Reference: MB1329; Path: ws/MCD_ApplicationBoards/Lists/MCDPARTSdatabase; Item Type: Item; Internal_Part_Number: MCD-00285; Status: Released; Part_Type: Resistor; Package: R0402; ComponentLink1Description: Datasheet; ComponentLink1URL: http://tunmcdsvn.tun.st.com/Component_Datasheet_Library/Trunk/Resistors/Yageo_Resistor_RC0402-series
R272 R286 R289 = MCD-00053: as R182 on sheet STM32_microcontroller_power; Internal_Part_Number: MCD-00053; Status: Released; Part_Type: Resistor; Package: R0402; ComponentLink1Description: Datasheet; ComponentLink1URL: http://tunmcdsvn.tun.st.com/Component_Datasheet_Library/Trunk/Resistors/Yageo_Resistor_RC0402-series
R292 = MCD-00422: Resistor,20K,0603,1%,1/10W; Manufacturer_Part_Number: RC0603FR-0720KL; Manufacturer: YAGEO; Provided_By: SUBCO; Initial_Board_Reference: MBxxxx; Path: ws/MCD_ApplicationBoards/Lists/MCDPARTSdatabase; Item Type: Item; Internal_Part_Number: MCD-00422; Status: Released; Part_Type: Resistor; Package: R0603; ComponentLink1Description: Datasheet; ComponentLink1URL: http://tunmcdsvn.tun.st.com/Component_Datasheet_Library/Trunk/Resistors/Yageo_Resistor_RC0603-series
R293 = MCD-01155: Resistor,10K2,0603,1%,1/10W; Manufacturer_Part_Number: RC0603FR-0710K2L; Manufacturer: YAGEO; Provided_By: SUBCO; Initial_Board_Reference: MB1372; Path: ws/MCD_ApplicationBoards/Lists/MCDPARTSdatabase; Item Type: Item; Internal_Part_Number: MCD-01155; Status: Released; Part_Type: Resistor; Package: R0603; ComponentLink1Description: Datasheet; ComponentLink1URL: http://tunmcdsvn.tun.st.com/Component_Datasheet_Library/Trunk/Resistors/Yageo_Resistor_RC0603-series
RV3 = MCD-01156: TRIMMER 50K OHM 0.5W PC PIN; Part_Type: Resistor; Manufacturer_Part_Number: 3386P-1-503; Manufacturer: BOURNS; Provided_By: SUBCO; Initial_Board_Reference: MB1372; Path: ws/MCD_ApplicationBoards/Lists/MCDPARTSdatabase; Item Type: Item; Internal_Part_Number: MCD-01156; Status: Released; ComponentLink1Description: Datasheet; ComponentLink1URL: http://tunmcdsvn.tun.st.com/Component_Datasheet_Library/Trunk/Resistors/Bourns_Potentiometer_3386_series
SB42 SB47 SB48 = MCD-00071: as SB31 on sheet STM32_microcontroller_power; Internal_Part_Number: MCD-00071; Status: Released; ComponentLink1Description: Datasheet; Package: SB0603; ComponentLink1URL: http://tunmcdsvn.tun.st.com/Component_Datasheet_Library/Trunk/Resistors/Yageo_Resistor_RC0603-series
TP4 TP5 TP7-TP9 = MCD-00074: Test Point 1mm; Part_Type: Mechanical; Initial_Board_Reference: MB1274; Path: ws/MCD_ApplicationBoards/Lists/MCDPARTSdatabase; Item Type: Item; Internal_Part_Number: MCD-00074; Provided_By: n/a; Status: Released; ComponentLink1Description: Datasheet; ComponentLink1URL: http://na; Manufacturer: n/a; Manufacturer_Part_Number: n/a
U29 = MCD-00078: Ultra low drop-low noise BiCMOS voltage, regulators low ESR capacitors compatible; Manufacturer: STMICROELECTRONICS; Part_Type: IC; BMS_Part_Number: 9176159; Provided_By: SUBCO with ST control; Initial_Board_Reference: MB1274; Path: ws/MCD_ApplicationBoards/Lists/MCDPARTSdatabase; Item Type: Item; Value: LD3985M18R; Internal_Part_Number: MCD-00078; Manufacturer_Part_Number: LD3985M18R; ComponentLink1Description: Datasheet; Status: Released; ComponentLink1URL: http://tunmcdsvn.tun.st.com/Component_Datasheet_Library/Trunk/IC/STM_LDO_LD3985
U33 = MCD-01231: 3000 W Transil; Part_Type: Diode; Manufacturer: STMICROELECTRONICS; Provided_By: SUBCO with ST control; Initial_Board_Reference: MB1397; Path: ws/MCD_ApplicationBoards/Lists/MCDPARTSdatabase; Item Type: Item; Internal_Part_Number: MCD-01231; Status: Footprint available; Manufacturer_Part_Number: SMC30J5.0A; ComponentLink1Description: Datasheet; ComponentLink1URL: http://tunmcdsvn.tun.st.com/Component_Datasheet_Library/Trunk/Diodes/STM_ESD_SMC30J
U37 = MCD-01237: 4A step-down switching regulator; Part_Type: IC; Manufacturer: STMICROELECTRONICS; Provided_By: SUBCO with ST control; Initial_Board_Reference: MB1397; Path: ws/MCD_ApplicationBoards/Lists/MCDPARTSdatabase; Item Type: Item; Internal_Part_Number: MCD-01237; Status: Footprint available; Manufacturer_Part_Number: ST1S41PHR; Package: HSOP8; ComponentLink1Description: Datasheet; ComponentLink1URL: http://tunmcdsvn.tun.st.com/Component_Datasheet_Library/Trunk/IC/STM_Buck_converter_ST1S41
U43 = MCD-01238: 3000 W Transil; Part_Type: Diode; Manufacturer: STMICROELECTRONICS; Provided_By: SUBCO with ST control; Initial_Board_Reference: MB1397; Path: ws/MCD_ApplicationBoards/Lists/MCDPARTSdatabase; Item Type: Item; Internal_Part_Number: MCD-01238; Status: Footprint available; Manufacturer_Part_Number: SMC30J18A; ComponentLink1Description: Datasheet; ComponentLink1URL: http://tunmcdsvn.tun.st.com/Component_Datasheet_Library/Trunk/Diodes/STM_ESD_SMC30J
U47 = MCD-01025: LDO, 3.3V, 1.3A, Very low quiescent current BiCMOS voltage regulator; Part_Type: IC; Manufacturer: STMICROELECTRONICS; BMS_Part_Number: 9176246; Provided_By: SUBCO with ST control; Initial_Board_Reference: MB1331; Path: ws/MCD_ApplicationBoards/Lists/MCDPARTSdatabase; Item Type: Item; Internal_Part_Number: MCD-01025; Status: Released; Manufacturer_Part_Number: ST1L05CPU33R; Package: DFN6-3x3; ComponentLink1Description: Datasheet; ComponentLink1URL: http://tunmcdsvn.tun.st.com/Component_Datasheet_Library/Trunk/IC/STM_LDO_ST1L05CPU33R
U48 = MCD-00581: LDO Linear Voltage Regulator IC Positive Adjustable 1 Output Adjustable 1.3A 6-DFN (3x3); Manufacturer: STMICROELECTRONICS; BMS_Part_Number: 9176239; Provided_By: SUBCO with ST control; Initial_Board_Reference: MB1331; Path: ws/MCD_ApplicationBoards/Lists/MCDPARTSdatabase; Item Type: Item; Internal_Part_Number: MCD-00581; Value: ST1L05BPUR; Status: Released; Part_Type: IC; Manufacturer_Part_Number: ST1L05BPUR; Package: DFN6 (3x3); ComponentLink1Description: Datasheet; ComponentLink1URL: http://tunmcdsvn.tun.st.com/Component_Datasheet_Library/Trunk/IC/STM_LDO_ST1L05BPUR

## Sheet HW_Mechanical_Parts.SchDoc: HW_Mechanical_Parts
size A4; Date: Not used; ApprovedBy: Not used; CheckedBy: Not used; Author: Not used; CompanyName: STMicroelectronics; DrawnBy: Not used; Engineer: Not used; Organization: Not used; Address1: Not used; Address2: Not used; Address3: Not used; Address4: Not used; DocumentNumber: Not used; Revision: Not used; SheetNumber: 22; SheetTotal: 22; CurrentTime: Not used; CurrentDate: Not used; Time: Not used; DocumentFullPathAndName: Not used; DocumentName: Not used; ModifiedDate: Not used; ImagePath: Not used; ProjectName: Not used; Application_BuildNumber: Not used
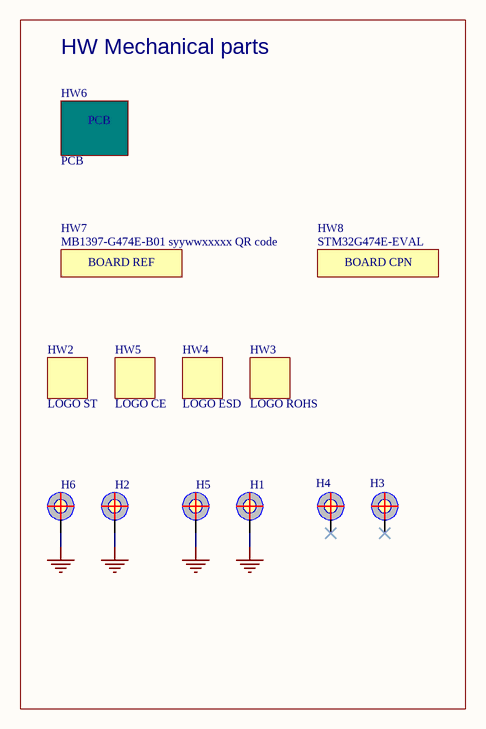
[diagram p12: HW_Mechanical_Parts.SchDoc]

### Parts
H1  POSITION HOLE C7D3R5  [PTH_350_700]  (value not drawn)  (no BOM)
H2  POSITION HOLE C7D3R5  [PTH_350_700]  (value not drawn)  (no BOM)
H3  POSITION HOLE C3R5D3R5  [NPTH_350]  (value not drawn)  (no BOM)
H4  POSITION HOLE C3R5D3R5  [NPTH_350]  (value not drawn)  (no BOM)
H5  POSITION HOLE C7D3R5  [PTH_350_700]  (value not drawn)  (no BOM)
H6  POSITION HOLE C7D3R5  [PTH_350_700]  (value not drawn)  (no BOM)
HW2  value LOGO ST  [LOGO_ST]  (hidden comment: Logo)  (no BOM)
HW3  value LOGO ROHS  [LOGO_ROHS]  (hidden comment: Logo)  (no BOM)
HW4  value LOGO ESD  [LOGO_MAIN_1]  (hidden comment: Logo)  (no BOM)
HW5  value LOGO CE  [LOGO_CE]  (hidden comment: Logo)  (no BOM)
HW6  PCB
HW7  value MB1397-G474E-B01 syywwxxxxx QR code  [STICKER_25X9]  (hidden comment: STICKER_BOARD_REF)  (mechanical)
HW8  value STM32G474E-EVAL  (hidden comment: STICKER_BOARD_CPN)  (mechanical)

### Blocks framed on the sheet
HW Mechanical parts: H1-H6 HW2-HW8

### Nets
GND: H1.1 H2.1 H5.1 H6.1

Not connected (* = marked no-connect by the designer): H3 1*; H4 1*

### Notes on the sheet
- Title:
- Project:
- Size:
- Revision:
- Variant:
- A4
- -
- Date:
- Reference:
- Sheet:
- of
- (in symbol MCD-00235) BOARD REF
- (in symbol MCD-00549) BOARD CPN

### Library data of the parts
H1 H2 H5 H6 = MCD-00328: Part_Type: Mechanical; Initial_Board_Reference: MB1311; Path: ws/MCD_ApplicationBoards/Lists/MCDPARTSdatabase; Item Type: Item; Internal_Part_Number: MCD-00328; Status: Released; Provided_By: n/a; ComponentLink1Description: Datasheet
H3 H4 = MCD-01368: Part_Type: Mechanical; Initial_Board_Reference: MB1397; Path: ws/MCD_ApplicationBoards/Lists/MCDPARTSdatabase; Item Type: Item; Internal_Part_Number: MCD-01368; Status: Checked; Provided_By: n/a; ComponentLink1Description: Datasheet; Value: POSITION HOLE C3R5D3R5; Manufacturer_Part_Number: n/a; Manufacturer: n/a
HW2 = MCD-00625: STMicroelectronics logo footprint for PCB; Part_Type: Mechanical; Initial_Board_Reference: MB1331; Path: ws/MCD_ApplicationBoards/Lists/MCDPARTSdatabase; Item Type: Item; Internal_Part_Number: MCD-00625; Status: Released; Provided_By: n/a; Manufacturer_Part_Number: n/a; Manufacturer: n/a; ComponentLink1Description: Datasheet; ComponentLink1URL: http://na
HW3 = MCD-00628: ROHS logo footprint for PCB; Part_Type: Mechanical; Initial_Board_Reference: MB1331; Path: ws/MCD_ApplicationBoards/Lists/MCDPARTSdatabase; Item Type: Item; Internal_Part_Number: MCD-00628; Status: Released; Provided_By: n/a; ComponentLink1Description: Datasheet
HW4 = MCD-00627: Hand ESD logo footprint for PCB; Part_Type: Mechanical; Initial_Board_Reference: MB1331; Path: ws/MCD_ApplicationBoards/Lists/MCDPARTSdatabase; Item Type: Item; Internal_Part_Number: MCD-00627; Status: Released; Provided_By: n/a; Manufacturer_Part_Number: n/a; Manufacturer: n/a; ComponentLink1Description: Datasheet; ComponentLink1URL: http://na
HW5 = MCD-00626: CE logo footprint for PCB; Part_Type: Mechanical; Initial_Board_Reference: MB1331; Path: ws/MCD_ApplicationBoards/Lists/MCDPARTSdatabase; Item Type: Item; Internal_Part_Number: MCD-00626; Status: Released; Provided_By: n/a; ComponentLink1Description: Datasheet
HW6 = PCB: Manuf_Part_1: MB1397 PCB; Manuf_1: Jiubaba; Ordered by: Subcon; Fitted: YES; Revision: 17-Jul-2002: Re-released for DXP Platform.; ECCN_US/EU: n/a
HW7 = MCD-00235: Sticker to mention board reference + serial number; Part_Type: Mechanical; Provided_By: SUBCO; Initial_Board_Reference: MB1319; Path: ws/MCD_ApplicationBoards/Lists/MCDPARTSdatabase; Item Type: Item; Internal_Part_Number: MCD-00235; Status: Released; Manufacturer_Part_Number: n/a; Manufacturer: n/a; ComponentLink1Description: Datasheet; ComponentLink1URL: n/a
HW8 = MCD-00549: Sticker to mention board CPN code; Part_Type: Mechanical; Provided_By: Subcon; Initial_Board_Reference: mb1319; Internal_Part_Number: MCD-00549; ECCN_US: n/a; ECCN_EU: n/a; Status: Released